# EAGLE design EmonTxShieldV2.5 (EAGLE 6.5.0)
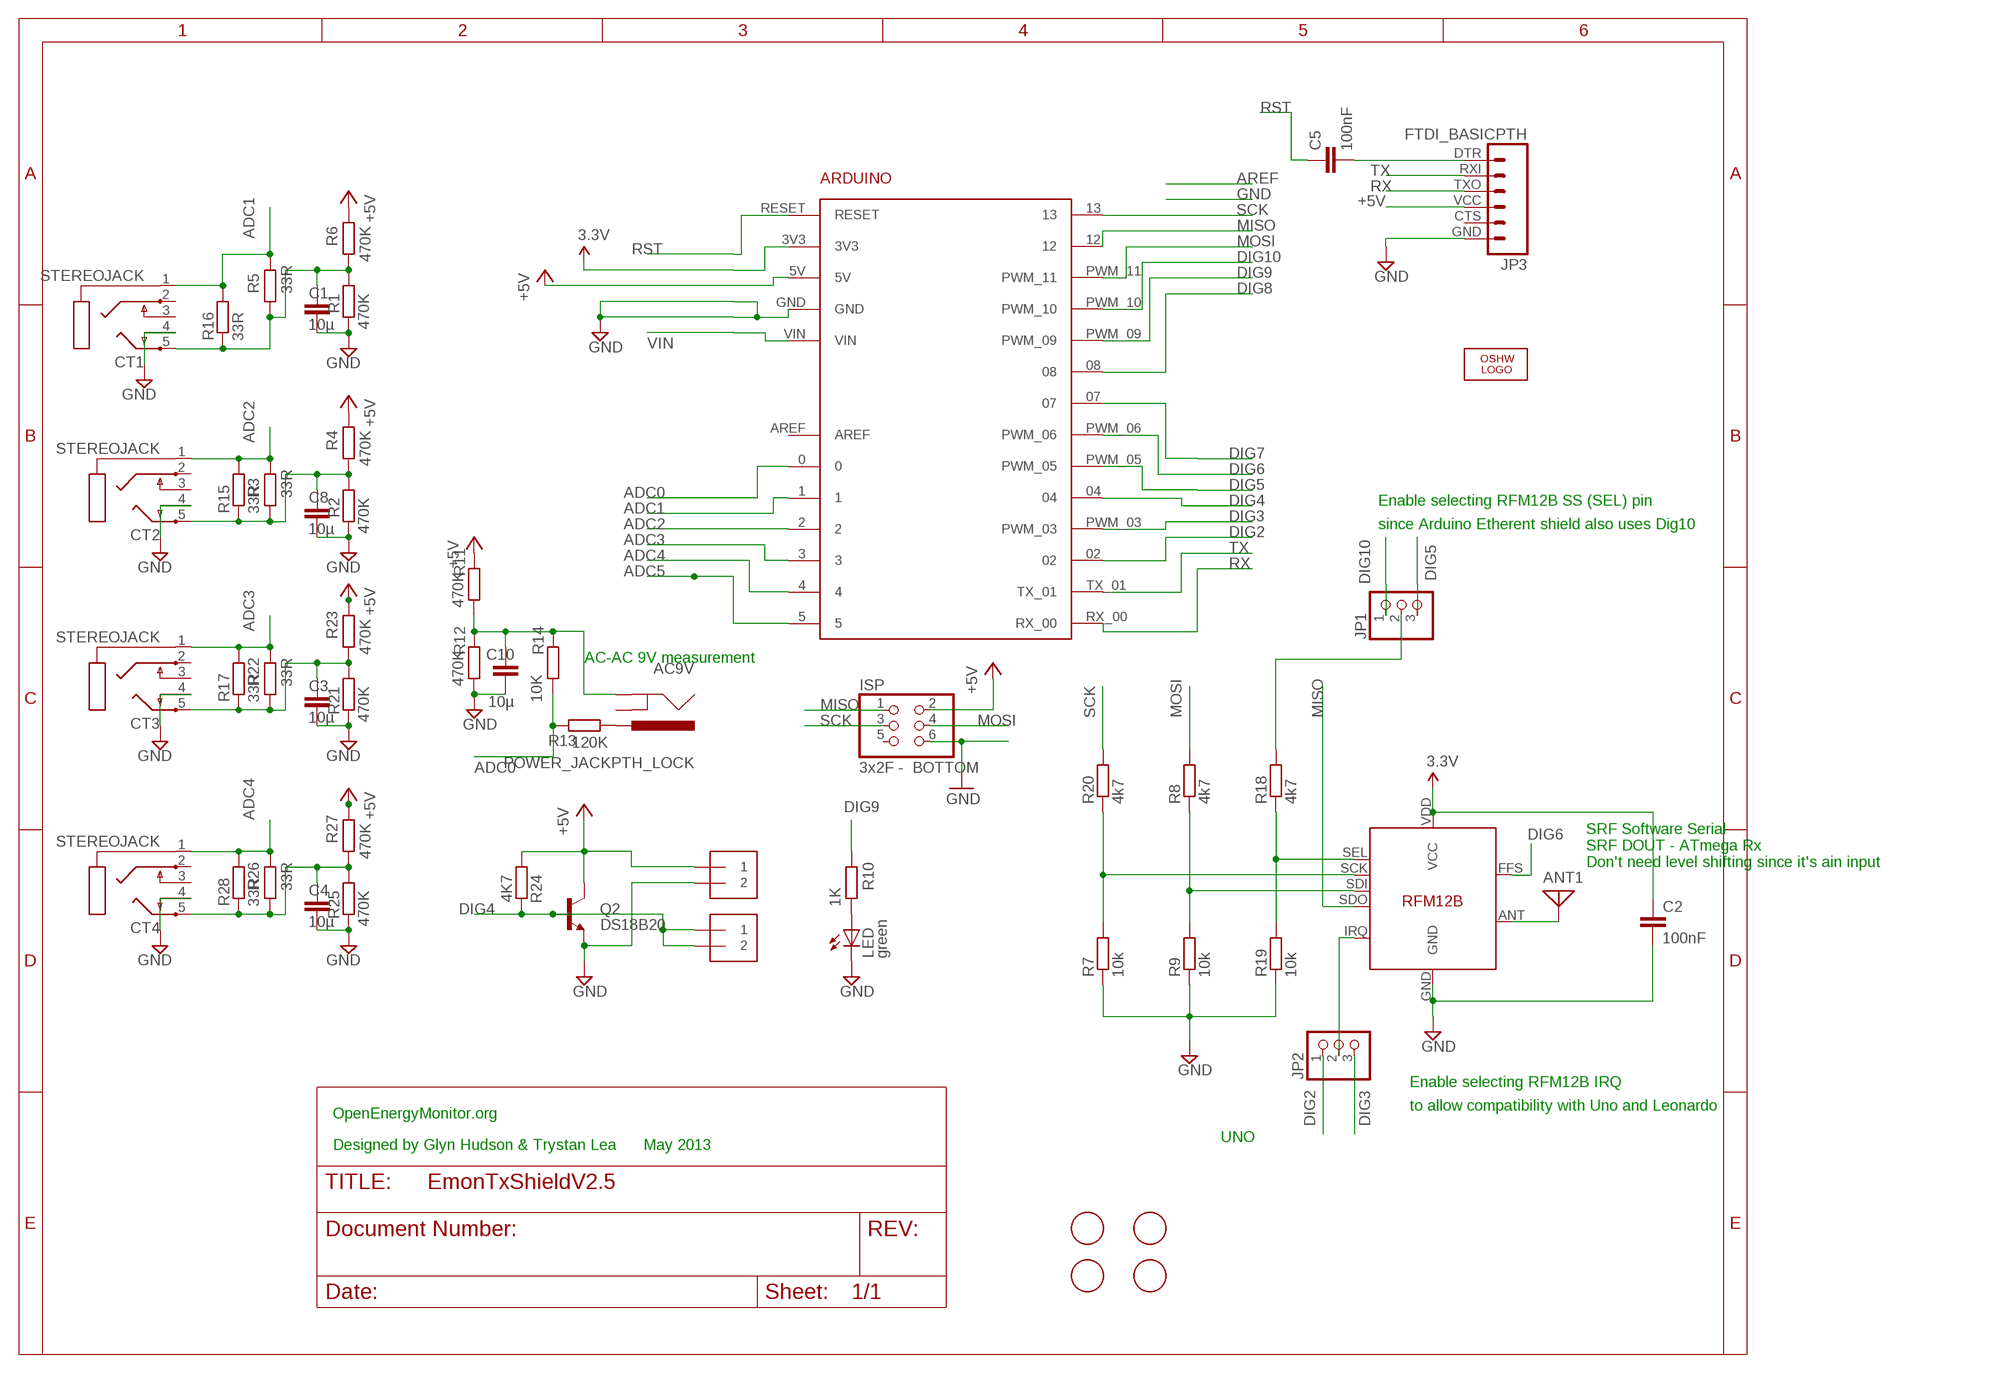
[diagram p0: schematic, sheet 1]

## Parts
AC9V  POWER_JACKPTH_LOCK  [POWER_JACK_PTH_LOCK]
ANT1  ANTENNA  [PAD-01]
ARDUINO1  ARDUINO2  [ARDUINO2]
C1  10µ  C-EUC0603  [C0603]
C2  100nF  C-EUC0603  [C0603]
C3  10µ  C-EUC0603  [C0603]
C4  10µ  C-EUC0603  [C0603]
C5  100nF  C-EUC0603  [C0603]
C8  10µ  C-EUC0603  [C0603]
C10  10µ  C-EUC0603  [C0603]
CT1  STEREOJACK  [STX3100]
CT2  STEREOJACK  [STX3100]
CT3  STEREOJACK  [STX3100]
CT4  STEREOJACK  [STX3100]
ISP  3x2F - BOTTOM  PINHD-2X3  [2X03]
J1  1X2-3.5MM  [1X2-3.5MM]
J2  1X2-3.5MM  [1X2-3.5MM]
JP1  PINHD-1X3  [1X03]
JP2  PINHD-1X3  [1X03]
JP3  FTDI_BASICPTH  [FTDI_BASIC]
LED  green  LEDCHIPLED_0805  [CHIPLED_0805]
LOGO1  OSHW_LOGO_10MILX0200-NT  [OSHW_10X200_NOTEXT]
Q2  DS18B20  TRANSISTOR_NPNTO92  [TO-92]
R1  470K  R-EU_R0603  [R0603]
R2  470K  R-EU_R0603  [R0603]
R3  33R  R-EU_0204/7  [0204/7]
R4  470K  R-EU_R0603  [R0603]
R5  33R  R-EU_0204/7  [0204/7]
R6  470K  R-EU_R0603  [R0603]
R7  10k  R-EU_R0603  [R0603]
R8  4k7  R-EU_R0603  [R0603]
R9  10k  R-EU_R0603  [R0603]
R10  1K  R-EU_R0603  [R0603]
R11  470K  R-EU_R0603  [R0603]
R12  470K  R-EU_R0603  [R0603]
R13  120K  R-EU_R0603  [R0603]
R14  10K  R-EU_R0603  [R0603]
R15  33R  R-EU_R1206  [R1206]
R16  33R  R-EU_R1206  [R1206]
R17  33R  R-EU_R1206  [R1206]
R18  4k7  R-EU_R0603  [R0603]
R19  10k  R-EU_R0603  [R0603]
R20  4k7  R-EU_R0603  [R0603]
R21  470K  R-EU_R0603  [R0603]
R22  33R  R-EU_0204/7  [0204/7]
R23  470K  R-EU_R0603  [R0603]
R24  4K7  R-EU_R0603  [R0603]
R25  470K  R-EU_R0603  [R0603]
R26  33R  R-EU_0204/7  [0204/7]
R27  470K  R-EU_R0603  [R0603]
R28  33R  R-EU_R1206  [R1206]
U$1  FIDUCIAL  [FIDUCIAL_1MM]
U$2  RFM12B  [RFM12B]
U$3  FIDUCIAL  [FIDUCIAL_1MM]
U$4  FIDUCIAL  [FIDUCIAL_1MM]
U$5  FIDUCIAL  [FIDUCIAL_1MM]

## Nets
3.3V [power]: ARDUINO1.3V3 C2.1 U$2.VDD(VCC)
+5V [power]: ARDUINO1.5V ISP.2 J1.1 JP3.VCC Q2.3(C) R4.2 R6.2 R11.2 R23.2 R24.1 R27.2
ADC0: ARDUINO1.0 R13.2 R14.1
ADC1: ARDUINO1.1 CT1.1 R5.2 R16.2
ADC2: ARDUINO1.2 CT2.1 R3.2 R15.2
ADC3: ARDUINO1.3 CT3.1 R17.2 R22.2
ADC4: ARDUINO1.4 CT4.1 R26.2 R28.2
ADC5: ARDUINO1.5
DIG2: ARDUINO1.02 JP2.1
DIG3: ARDUINO1.PWM_03 JP2.3
DIG4: ARDUINO1.04 J2.1 J2.2 Q2.2(B) R24.2
DIG5: ARDUINO1.PWM_05 JP1.3
DIG6: ARDUINO1.PWM_06 U$2.FFS
DIG7: ARDUINO1.07
DIG8: ARDUINO1.08
DIG9: ARDUINO1.PWM_09 R10.2
DIG10: ARDUINO1.PWM_10 JP1.1
GND [gnd]: ARDUINO1.GND C1.2 C2.2 C3.2 C4.2 C8.2 C10.2 CT1.4 CT2.4 CT3.4 CT4.4 ISP.6 J1.2 JP3.GND LED.C Q2.1(E) R1.2 R2.2 R7.1 R9.1 R12.1 R19.1 R21.2 R25.2 U$2.GND
MISO: ARDUINO1.12 ISP.1 U$2.SDO
MOSI: ARDUINO1.PWM_11 ISP.4 R8.2
N$1: JP2.2 U$2.IRQ
N$2: JP1.2 R18.2
N$3: C3.1 CT3.5 R17.1 R21.1 R22.1 R23.1
N$4: C4.1 CT4.5 R25.1 R26.1 R27.1 R28.1
N$5: AC9V.PWR R13.1
N$12: C5.2 JP3.DTR
N$33: C8.1 CT2.5 R2.1 R3.1 R4.1 R15.1
N$34: AC9V.GND C10.1 R11.1 R12.2 R14.2
N$38: C1.1 CT1.5 R1.1 R5.1 R6.1 R16.1
N$41: LED.A R10.1
N$42: ANT1.1 U$2.ANT
N$43: R7.2 R20.1 U$2.SCK
N$44: R8.1 R9.2 U$2.SDI
N$45: R18.1 R19.2 U$2.SEL
RST: ARDUINO1.RESET C5.1
RX: ARDUINO1.RX_00 JP3.TXO
SCK: ARDUINO1.13 ISP.3 R20.2
TX: ARDUINO1.TX_01 JP3.RXI
VIN: ARDUINO1.VIN
Unconnected: AC9V.GNDBREAK ARDUINO1.AREF CT1.2 CT1.3 CT2.2 CT2.3 CT3.2 CT3.3 CT4.2 CT4.3 ISP.5 JP3.CTS

## Notes on the sheet
- Enable selecting RFM12B SS (SEL) pin
- since Arduino Etherent shield also uses Dig10
- AC-AC 9V measurement
- SRF Software Serial
  SRF DOUT - ATmega Rx
  Don't need level shifting since it's ain input
- Enable selecting RFM12B IRQ
- to allow compatibility with Uno and Leonardo
- OpenEnergyMonitor.org
- UNO
- Designed by Glyn Hudson & Trystan Lea      May 2013

## Library data of the parts
AC9V = SparkFun:POWER_JACK: Power Jack This is the standard 5.5mm barrel jack for power. The PTH is the most common, proven, reliable, footprint. All others are experimental. The Slot footprint only works if the mill layer is transmitted to the PCB fab house so be warned. Spark Fun Electronics SKU : PRT-00119. Mating wall wart : TOL-00298 (and others)
ANT1 = discrete:ANTENNA: Antenna
ARDUINO1 = arduino:ARDUINO: For creating Arduino shields
C1-C5 C8 C10 = rcl:C-EU: CAPACITOR, European symbol
CT1-CT4 = adafruit:STEREOJACK: MIC/HEADPHONE JACK Stereo jack with two switches. Kycon STX3100, CUI SJ1-3555NG and/or 4UCon 05544
ISP = pinhead:PINHD-2X3: PIN HEADER
J1 J2 = adafruit:1X2: 3.5mm Terminal block http://www.ladyada.net/library/pcb/eaglelibrary.html
JP1 JP2 = adafruit:PINHD-1X3: PIN HEADER
JP3 = SparkFun:FTDI_BASIC: FTDI Basic: 3.3V and 5V
LED = led:LED: LED OSRAM: - CHIPLED LG R971, LG N971, LY N971, LG Q971, LY Q971, LO R971, LY R971 LH N974, LH R974 LS Q976, LO Q976, LY Q976 LO Q996 - Hyper CHIPLED LW Q18S LB Q993, LB Q99A, LB R99A - SideLED LS A670, LO A670, LY A670, LG A670, LP A670 LB A673, LV A673, LT A673, LW A673 LH A674 LY A675 LS A676, LA A676, LO A676, LY A676, LW A676 LS A679, LY A679, LG A679 - Hyper Micro SIDELED® LS Y876, LA Y876, LO Y876, LY Y876 LT Y87S - SmartLED LW L88C, LW L88S LB L89C, LB L89S, LG L890 LS L89K, LO L89K, LY L89K LS L896, LA L896, LO L896, LY L896 - TOPLED LS T670, LO T670, LY T670, LG T670, LP T670 LSG T670, LSP T670, LSY T670, LOP T670, LYG T670 LG T671, LOG T671, LSG T671 LB T673, LV T673, LT T673, LW T673 LH T674 LS T676, LA T676, LO T676, LY T676, LB T676, LH T676, LSB T676, LW T676 LB T67C, LV T67C, LT T67C, LS T67K, LO T67K, LY T67K, LW E67C LS E67B, LA E67B, LO E67B, LY E67B, LB E67C, LV E67C, LT E67C LW T67C LS T679, LY T679, LG T679 LS T770, LO T770, LY T770, LG T770, LP T770 LB T773, LV T773, LT T773, LW T773 LH T774 LS E675, LA E675, LY E675, LS T675 LS T776, LA T776, LO T776, LY T776, LB T776 LHGB T686 LT T68C, LB T68C - Hyper Mini TOPLED® LB M676 - Mini TOPLED Santana® LG M470 LS M47K, LO M47K, LY M47K Source: http://www.osram.convergy.de LUXEON: - LUMILED® LXK2-PW12-R00, LXK2-PW12-S00, LXK2-PW14-U00, LXK2-PW14-V00 LXK2-PM12-R00, LXK2-PM12-S00, LXK2-PM14-U00 LXK2-PE12-Q00, LXK2-PE12-R00, LXK2-PE12-S00, LXK2-PE14-T00, LXK2-PE14-U00 LXK2-PB12-K00, LXK2-PB12-L00, LXK2-PB12-M00, LXK2-PB14-N00, LXK2-PB14-P00, LXK2-PB14-Q00 LXK2-PR12-L00, LXK2-PR12-M00, LXK2-PR14-Q00, LXK2-PR14-R00 LXK2-PD12-Q00, LXK2-PD12-R00, LXK2-PD12-S00 LXK2-PH12-R00, LXK2-PH12-S00 LXK2-PL12-P00, LXK2-PL12-Q00, LXK2-PL12-R00 Source: www.luxeon.com KINGBRIGHT: KA-3528ASYC Source: www.kingbright.com
LOGO1 = ohw-logo:OSHW_LOGO_10MIL
Q2 = SparkFun:TRANSISTOR_NPN: Transistor NPN BJT configuration in SOT23 package. MMBT2222 is the common NPN we use. Double check BCE configuration again layout.
R1-R28 = rcl:R-EU_: RESISTOR, European symbol
U$1 U$3-U$5 = adafruit:FIDUCIAL: For use by pick and place machines to calibrate the vision/machine, 1mm By microbuilder.eu
U$2 = lh-library:RFM12B

## Net classes
0 default: width 0.203 mm, drill 0.6 mm, clearance 0.203 mm
1 power: width 0.305 mm, drill 0.6 mm, clearance 0.254 mm
2 gnd: width 0.254 mm, drill 0.6 mm, clearance 0.254 mm

## Board
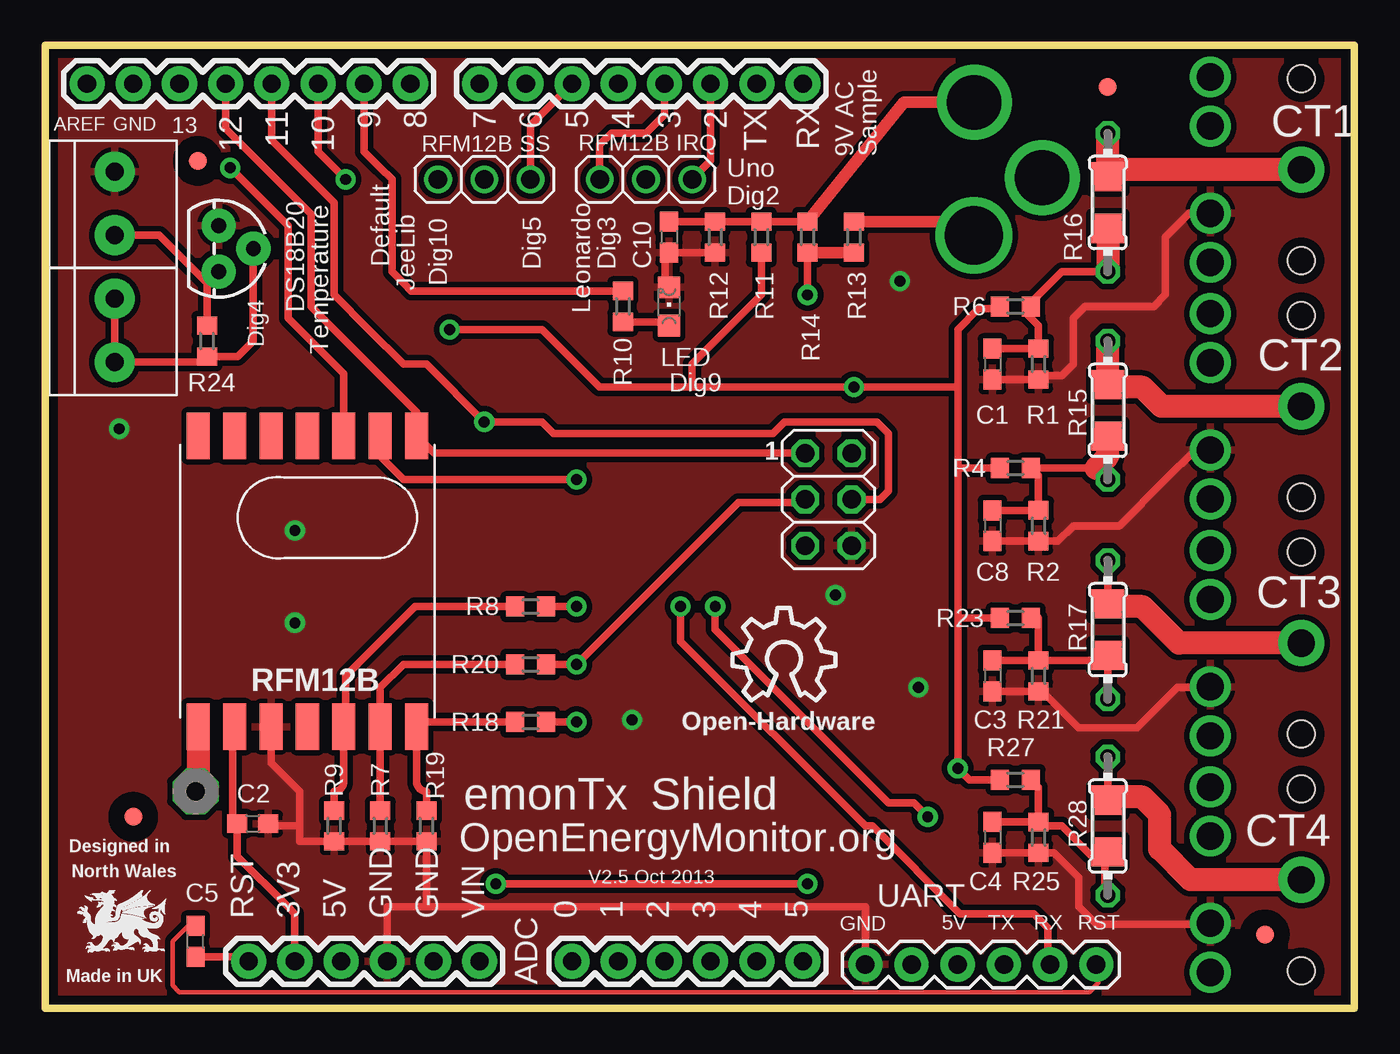
[diagram p1: board, top side]
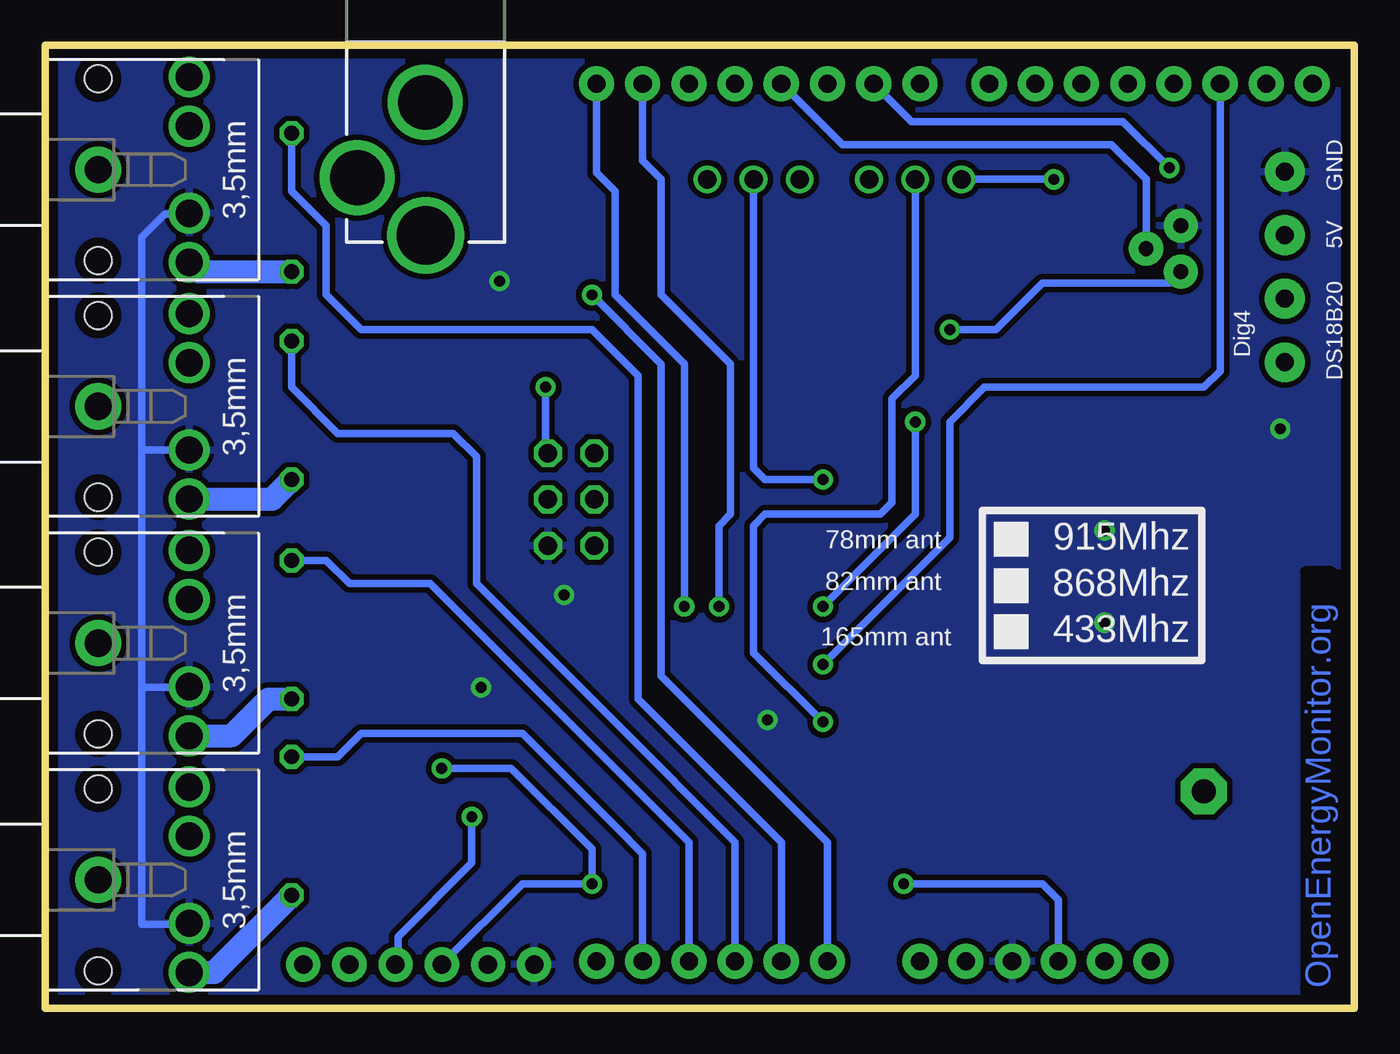
[diagram p2: board, bottom side, seen from below]

Size 71.96 x 52.95 mm. Coordinates in mm from the lower left corner, seen from the top.
Outline: 0,0 71.96,0 71.96,52.95 0,52.95 0,0
Copper layers (1*16): Top 0.035mm / dielectric 1.5mm / Bottom 0.035mm
Design rules "default": minimum track width 8mil, minimum drill 0.6mm, track to track 8mil, track to pad 10mil, pad to pad 10mil, via to via 10mil, smd to smd 10mil, copper to edge 20mil, drill to drill 16mil, minimum pad ring 10mil, minimum via ring 10mil, stop-mask expansion 0.075mm, vias tented up to drill 0.6mm, thermal gap 10mil

### Footprints (pad centres in the part's own frame; a part is rotated, then mirrored left to right if it is on the bottom)
POWER_JACK_PTH_LOCK = drill 2.997 pad 4.115: GND 0.025,6.557; GNDBREAK 3.762,10.7 | drill 3.2 pad 4.115: PWR 0,13.878
PAD-01 = drill 1.321 pad 2.54 octagon: 1 0,0
ARDUINO2 = drill 1 pad 1.93: 0 0,12.7; 1 0,10.16; 2 0,7.62; 02 48.26,5.08; 3 0,5.08; 3V3 0,27.94; 4 0,2.54; 04 48.26,10.16; 5 0,0; 5V 0,25.4; 07 48.26,17.78; 08 48.26,21.59; 12 48.26,31.75; 13 48.26,34.29; AREF 48.26,39.37; GND 0,22.86; GND1 0,20.32; GND2 48.26,36.83; PWM_03 48.26,7.62; PWM_05 48.26,12.7; PWM_06 48.26,15.24; PWM_09 48.26,24.13; PWM_10 48.26,26.67; PWM_11 48.26,29.21; RESET 0,30.48; RX_00 48.26,0; TX_01 48.26,2.54; VIN 0,17.78
C0603 = smd 1.1 x 1: 1 -0.85,0; 2 0.85,0
STX3100 = drill 1.5 pad 2.54: 1 2.7,-0.1 | drill 1.5: 2 7.7,5; 3 7.7,2.3; 4 7.7,-2.5; 5 7.7,-5.2 | hole 1.5: 2.7,4.9; 2.7,-5.1
2X03 = drill 1.016 octagon: 1 -2.54,-1.27; 2 -2.54,1.27; 3 0,-1.27; 4 0,1.27; 5 2.54,-1.27; 6 2.54,1.27
1X2-3.5MM = drill 1 pad 2.184: 1 1.8,0; 2 -1.7,0
1X03 = drill 1.016: 1 -2.54,0; 2 0,0; 3 2.54,0
FTDI_BASIC = drill 1.016 pad 1.88: CTS 10.16,0; DTR 0,0; GND 12.7,0; RXI 2.54,0; TXO 5.08,0; VCC 7.62,0
CHIPLED_0805 = smd 1.2 x 1.2: A 0,-1.05; C 0,1.05
TO-92 = drill 0.813 pad 1.88: 1 -1.27,0; 2 0,1.905; 3 1.27,0
R0603 = smd 1 x 1.1: 1 -0.85,0; 2 0.85,0
0204/7 = drill 0.813 octagon: 1 -3.81,0; 2 3.81,0
R1206 = smd 1.6 x 1.803: 1 -1.422,0; 2 1.422,0
FIDUCIAL_1MM = smd 1 x 1: 1 0,0
RFM12B = smd 2.54 x 1.27: ANT 8,-6; FFS -8,2; GND 8,-2; IRQ -8,4; P$8 -8,0; P$9 -8,-2; P$10 -8,-4; P$12 -8,-6; P$16 8,0; SCK 8,4; SDI 8,2; SDO -8,6; SEL 8,6; VDD 8,-4

### Placement (x,y rotation side)
AC9V  51.05,56.38 180 bottom
ANT1  8.26,11.93 0 top
ARDUINO1  41.66,2.58 90 top
C1  52.07,35.43 270 top
C2  11.4,10.15 0 top
C3  52.07,18.28 270 top
C4  52.07,9.39 270 top
C5  8.26,3.67 90 top
C8  52.07,26.54 270 top
C10  34.29,42.41 270 top
CT1  71.75,46.22 0 bottom
CT2  71.75,33.2 0 bottom
CT3  71.75,20.18 0 bottom
CT4  71.75,7.17 0 bottom
ISP  43.05,27.98 270 top
J1  3.81,44.32 270 top
J2  3.81,37.33 270 top
JP1  24.13,45.59 0 top
JP2  33.02,45.59 180 top
JP3  57.78,2.41 180 top
LED  34.29,38.6 0 top
LOGO1  37.77,16.93 0 top
Q2  9.53,41.77 270 top
R1  54.61,35.43 270 top
R2  54.61,26.54 270 top
R3  58.42,32.89 90 top
R4  53.34,29.71 180 top
R5  58.42,44.32 90 top
R6  53.34,38.6 180 top
R7  18.41,10.03 90 top
R8  26.67,22.09 0 top
R9  15.88,10.03 90 top
R10  31.75,38.6 90 top
R11  39.37,42.41 270 top
R12  36.83,42.41 90 top
R13  44.45,42.41 270 top
R14  41.91,42.41 90 top
R15  58.42,32.89 90 top
R16  58.42,44.32 90 top
R17  58.42,20.82 90 top
R18  26.67,15.74 0 top
R19  20.95,10.03 90 top
R20  26.67,18.91 0 top
R21  54.61,18.28 270 top
R22  58.42,20.82 90 top
R23  53.34,21.45 180 top
R24  8.89,36.7 270 top
R25  54.61,9.39 270 top
R26  58.42,10.03 90 top
R27  53.34,12.56 180 top
R28  58.42,10.03 90 top
U$1  58.42,50.66 0 top
U$2  14.4,23.49 270 top
U$3  67.06,4.06 0 top
U$4  8.38,46.6 0 top
U$5  4.83,10.53 0 top

### Tracks (layer width: path | path; a pad name or v marks a point on that pad's centre or on a via)
3.3V
  Top 0.406: U$2.VDD 10.29,15.37 10.29,10.15 C2.1 10.55,8.36 13.34,5.58 13.72,5.2 ARDUINO1.3V3
+5V  (via drill 0.6)
  Top 0.406: R24.1 8.89,39.87 | 8.89,39.87 Q2.3 | 8.89,39.87 6.25,42.52 J1.1 | 50.16,21.45 v50.16,13.2 50.8,12.56 R27.2 | 50.16,21.45 50.16,29.71 | 50.16,29.71 50.16,34.16 | R4.2 50.16,29.71 | R23.2 50.16,21.45 | R11.2 39.37,39.23 35.56,35.43 35.56,34.16 | 50.16,34.16 v44.45,34.16 35.56,34.16 | 35.56,34.16 30.48,34.16 27.3,37.33 v22.23,37.33 | v41.91,6.85 v24.77,6.85 | 50.16,34.16 50.16,37.33 51.31,38.47 52.36,38.47 R6.2
  Bottom 0.406: J1.1 3.81,42.41 | Q2.3 10.16,39.87 17.14,39.87 19.68,37.33 v22.23,37.33 | ISP.2 44.45,30.65 v44.45,34.16 | JP3.VCC 45.72,6.85 v41.91,6.85 41.91,8.76 46.35,13.2 v50.16,13.2 | v24.77,6.85 17.14,6.85 16.26,5.96 ARDUINO1.5V
ADC0  (via drill 0.6)
  Top 0.406: R14.1 v41.91,39.23
  Top 0.635: R13.2 R14.1
  Bottom 0.406: ARDUINO1.0 28.96,9.14 38.1,18.28 38.1,35.43 v41.91,39.23
ADC1
  Top 0.406: 58.8,46.12 R16.2
  Top 1.27: CT1.1 58.8,46.12 | R16.2 R5.2
  Bottom 0.406: ARDUINO1.1 31.5,9.14 31.75,9.39 39.37,17.01 39.37,34.79 41.91,37.33 54.61,37.33 56.52,39.23 56.52,43.05 58.42,44.95 R5.2
ADC2
  Top 0.406: 58.57,34.16 R15.2 58.57,34.16
  Top 1.27: CT2.1 61.38,33.1 60.33,34.16 58.57,34.16 | R15.2 R3.2
  Bottom 0.406: ARDUINO1.2 34.04,9.14 40.64,15.74 48.26,23.36 48.26,30.34 49.53,31.61 55.88,31.61 58.42,34.16 R3.2
ADC3
  Top 0.406: 58.57,22.09 R17.2 R22.2
  Top 1.27: 58.57,22.09 60.33,22.09 61.7,20.72 62.33,20.08 CT3.1
  Bottom 0.406: ARDUINO1.3 36.58,9.14 50.8,23.36 55.24,23.36 56.52,24.63 R22.2
ADC4
  Top 0.406: R26.2 R28.2 58.59,11.61 | 61.28,10.34 61.28,10.66
  Top 1.27: CT4.1 62.97,7.07 61.28,8.76 61.28,10.34 | 61.28,10.66 60.33,11.61 58.59,11.61
  Bottom 0.406: ARDUINO1.4 39.12,8.5 40.64,10.03 41.91,11.29 45.72,15.11 54.61,15.11 55.88,13.84 R26.2
DIG2
  Top 0.406: ARDUINO1.02 36.58,46.6 JP2.1
DIG3
  Top 0.406: ARDUINO1.PWM_03 34.04,49.14 33.02,48.12 31.11,48.12 30.48,47.49 JP2.3
DIG4
  Top 0.406: J2.2 J2.1 8.57,35.53 R24.2 10.58,35.84 10.79,36.06 11.43,36.7 11.43,37.33 Q2.2
  Bottom 0.406: ARDUINO1.04 28.14,47.49 13.34,47.49 11.43,45.59 Q2.2
DIG5
  Top 0.406: ARDUINO1.PWM_05 26.67,48.56 JP1.3
DIG6  (via drill 0.6)
  Top 0.406: U$2.FFS 16.4,34.9 13.34,37.97 13.34,43.05 10.79,45.59 v10.16,46.22
  Bottom 0.406: ARDUINO1.PWM_06 24.33,48.76 13.34,48.76 12.7,48.76 v10.16,46.22
DIG9
  Top 0.406: ARDUINO1.PWM_09 17.53,47.11 18.41,46.22 19.05,45.59 19.05,40.51 19.68,39.87 20.11,39.45 R10.2
DIG10  (via drill 0.6)
  Top 0.406: ARDUINO1.PWM_10 14.99,47.11 v16.51,45.59
  Bottom 0.406: v16.51,45.59 JP1.1
GND  (via drill 0.6)
  Top 0.406: U$2.GND 12.4,13.5 13.97,11.93 13.97,10.03 | 13.97,10.03 13.97,9.18 R9.1 R7.1 R19.1 20.95,8.76 20.95,5.58 | C2.2 12.26,10.03 13.97,10.03 | ARDUINO1.GND 18.8,5.58 19.68,5.58 20.95,5.58 | R12.1 C10.2 34.08,41.56 34.08,39.87 LED.C | C1.2 R1.2 54.83,34.79 55.88,34.79 56.52,35.43 56.52,37.97 57.15,38.6 60.96,38.6 61.59,39.23 61.59,42.41 62.91,43.72 CT1.4 | CT2.4 63.22,30.7 61.59,29.07 59.05,26.54 56.52,26.54 55.66,25.68 R2.2 C8.2 | CT3.4 63.54,17.68 63.5,17.64 62.23,17.64 60.01,15.42 59.37,15.42 58.74,15.42 56.83,15.42 54.83,17.43 R21.2 C3.2 | C4.2 R25.2 55.46,8.54 56.83,7.17 56.83,5.58 57.47,4.95 57.78,4.63 64.02,4.63 CT4.4 | 20.95,5.58 45.09,5.58 JP3.GND
  Bottom 0.406: 66.67,17.64 66.67,28.44 66.67,30.98 | 66.67,17.64 66.67,17.01 66.67,4.63 64.14,4.63 | CT1.4 64.09,43.68 65.41,43.68 66.67,42.41 66.67,30.98 | CT2.4 66.4,30.7 arc90 66.67,30.98 | CT3.4 64.09,17.64 66.67,17.64
  other vias: 13.72,26.28 13.72,21.2 4.06,31.87 43.43,22.72 46.99,40 32.26,15.87 48.01,17.64
  pour Bottom (isolate 0.305): -1.27,53.84 -1.27,-2.04 73.66,-2.04 73.66,53.84
  pour Top (isolate 0.305): -1.27,53.84 73.66,53.84 73.66,-2.04 -1.27,-2.04
MISO
  Top 0.406: ISP.1 21.37,30.52 U$2.SDO 20.4,32.8 14.61,38.6 14.61,43.68 9.91,48.38 ARDUINO1.12
MOSI  (via drill 0.6)
  Top 0.406: ISP.4 45.9,27.98 46.35,28.44 46.35,31.61 45.72,32.25 40.64,32.25 40.01,31.61 27.94,31.61 27.3,32.25 v24.13,32.25 20.95,35.43 19.68,35.43 17.78,37.33 15.88,39.23 15.88,44.32 12.45,47.74 ARDUINO1.PWM_11 | R8.2 v29.21,22.09
  Bottom 0.406: v24.13,32.25 24.13,27.17 v29.21,22.09
N$1  (via drill 0.6)
  Top 0.406: U$2.IRQ 18.4,30.36 19.68,29.07 v29.21,29.07
  Bottom 0.406: v29.21,29.07 32.38,29.07 33.02,29.71 JP2.2
N$2  (via drill 0.6)
  Top 0.406: R18.2 v29.21,15.74
  Bottom 0.406: JP1.2 24.13,34.79 25.4,33.52 25.4,27.8 26.04,27.17 32.38,27.17 33.02,26.54 33.02,19.55 v29.21,15.74
N$3
  Top 0.406: R23.1 54.61,21.45 R21.1 | R21.1 C3.1 | R21.1 58.42,19.13 | 58.42,19.13 R17.1 | 58.42,19.13 R22.1
  Bottom 1.27: CT3.5 61.72,14.98 59.69,17.01 R22.1
N$4
  Top 0.406: C4.1 R25.1 | R27.1 54.61,12.14 R25.1 | R25.1 54.83,10.03 55.88,10.03 57.47,8.44 58.26,8.44 | 58.26,8.44 R28.1 | 58.26,8.44 58.26,6.38 R26.1
  Bottom 1.27: CT4.5 62.67,1.97 R26.1
N$5
  Top 0.635: R13.1 50.04,43.26 arc-90 AC9V.PWR
N$12
  Top 0.254: C5.2 7.83,4.53 6.99,3.67 6.99,1.26 7.37,0.88 57.4,0.88 57.91,1.39 57.91,2.28 JP3.DTR
N$33
  Top 0.406: R2.1 54.61,29.29 R4.1 57.78,29.71 R3.1 | C8.1 R2.1 | R2.1 54.61,27.17
  Top 1.27: 57.78,29.71 58.42,30.34 R15.1
  Bottom 1.27: CT2.5 59.49,28 R3.1
N$34
  Top 0.406: C10.1 R12.2 R11.1 R14.2
  Top 0.635: R14.2 47.2,49.82 AC9V.GND
N$38
  Top 0.406: 58,40.51 R5.1 55.88,40.51 54.19,38.82 R6.1 53.98,38.18 | 53.98,38.18 53.98,38.6 | 53.98,38.18 54.61,37.55 R1.1 C1.1
  Top 1.27: R16.1 R5.1
  Bottom 1.27: CT1.5 63.54,40.51 R5.1
N$41
  Top 0.406: R10.1 34.09,37.75 LED.A
N$42
  Top 0.406: 8.4,12.71 ANT1.1
  Top 1.27: U$2.ANT 8.4,12.71
N$43
  Top 0.406: R7.2 arc-90 18.4,10.89 U$2.SCK 18.4,17.63 19.68,18.91 R20.1
N$44
  Top 0.406: R9.2 15.88,11.93 arc90 16.4,12.46 U$2.SDI 16.51,15.6 16.51,18.28 20.32,22.09 R8.1
N$45
  Top 0.406: U$2.SEL 20.4,12.48 arc90 20.95,11.93 R19.2 | 20.4,15.74 U$2.SEL | R18.1 20.66,15.74 U$2.SEL
RST
  Top 0.406: C5.1 10.93,2.83 ARDUINO1.RESET
RX  (via drill 0.6)
  Top 0.406: v36.83,22.09 36.83,20.82 46.35,11.29 47.75,11.29 v48.51,10.53
  Bottom 0.406: ARDUINO1.RX_00 41.66,45.97 40.64,44.95 40.64,39.23 36.83,35.43 v36.83,22.09 | v48.51,10.53 48.51,7.99 52.58,3.93 52.58,2.15 52.83,1.9 52.83,2.28 JP3.TXO
SCK  (via drill 0.6)
  Top 0.406: 41.6,27.8 ISP.3 41.6,27.8 | R20.2 v29.21,18.91 38.1,27.8 41.6,27.8
  Bottom 0.406: ARDUINO1.13 7.37,35.04 8.26,34.16 20.32,34.16 22.23,32.25 22.23,25.9 v29.21,18.91
TX  (via drill 0.6)
  Top 0.406: v34.92,22.09 34.92,20.18 45.09,10.03 45.47,10.03 50.29,5.2 54.36,5.2 55.12,4.44 55.12,2.53 JP3.RXI
  Bottom 0.406: ARDUINO1.TX_01 39.12,46.6 38.1,45.59 38.1,39.23 34.92,36.06 34.29,35.43 34.29,27.17 34.92,26.54 v34.92,22.09

### Text on the board
Bottom: OpenEnergyMonitor.org
bNames: GND | 5V | Dig4 | DS18B20 | 915Mhz | 78mm ant | 868Mhz | 82mm ant | 433Mhz | 165mm ant
tSilk: TX | AREF | GND | 13 | 9 | 8 | 7 | 6 | 5 | 4 | 3 | 2 | RFM12B SS | RFM12B IRQ | 12 | 11 | 10 | RX | 9V AC | Sample | Uno | Default | Leonardo | Dig2 | Dig5 | Dig3 | JeeLib | Dig10 | Dig4 | Temperature | Dig9 | 1 | Open-Hardware | emonTx | Shield | Designed in | OpenEnergyMonitor.org | North Wales | V2.5 Oct 2013 | UART | RST | 3V3 | 5V | GND | GND | VIN | 0 | 1 | 2 | 3 | 4 | 5 | GND | 5V | TX | RX | RST | Made in UK | ADC
_tsilk: Designed in | North Wales | Made in UK
_bsilk: 165mm ant | 433Mhz | 165mm ant | 165mm ant | 433Mhz | 433Mhz | 868Mhz | 82mm ant | 82mm ant | 82mm ant | 868Mhz | 868Mhz | 78mm ant | 915Mhz | 78mm ant | 915Mhz | 78mm ant | 915Mhz | 165mm ant | 433Mhz | 82mm ant | 868Mhz | 78mm ant | 915Mhz